# Altium schematic sheet 20200804PCB.SchDoc
size A2
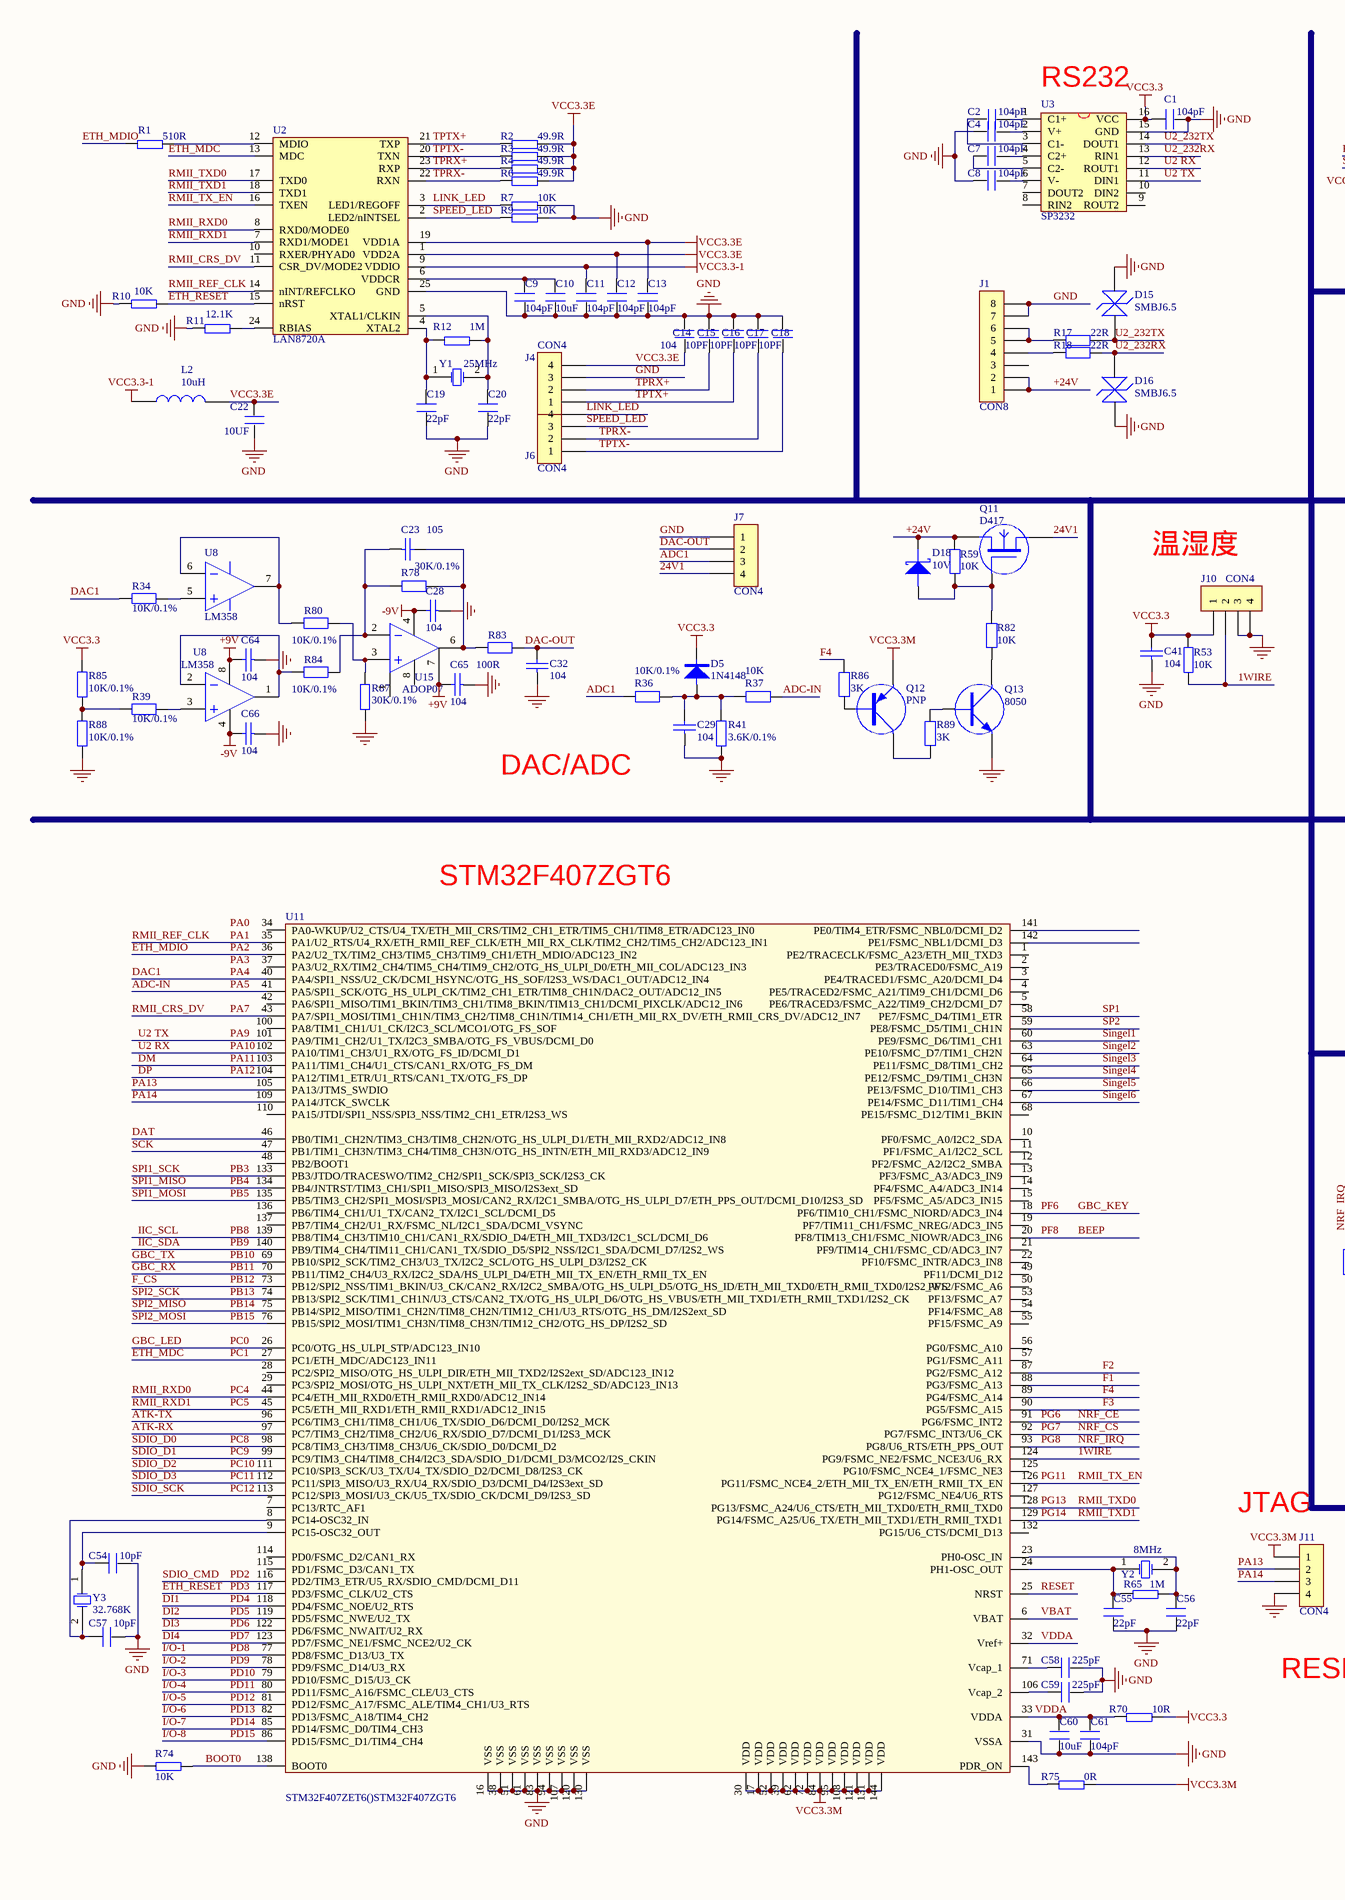
[diagram p0: 20200804PCB.SchDoc, left]
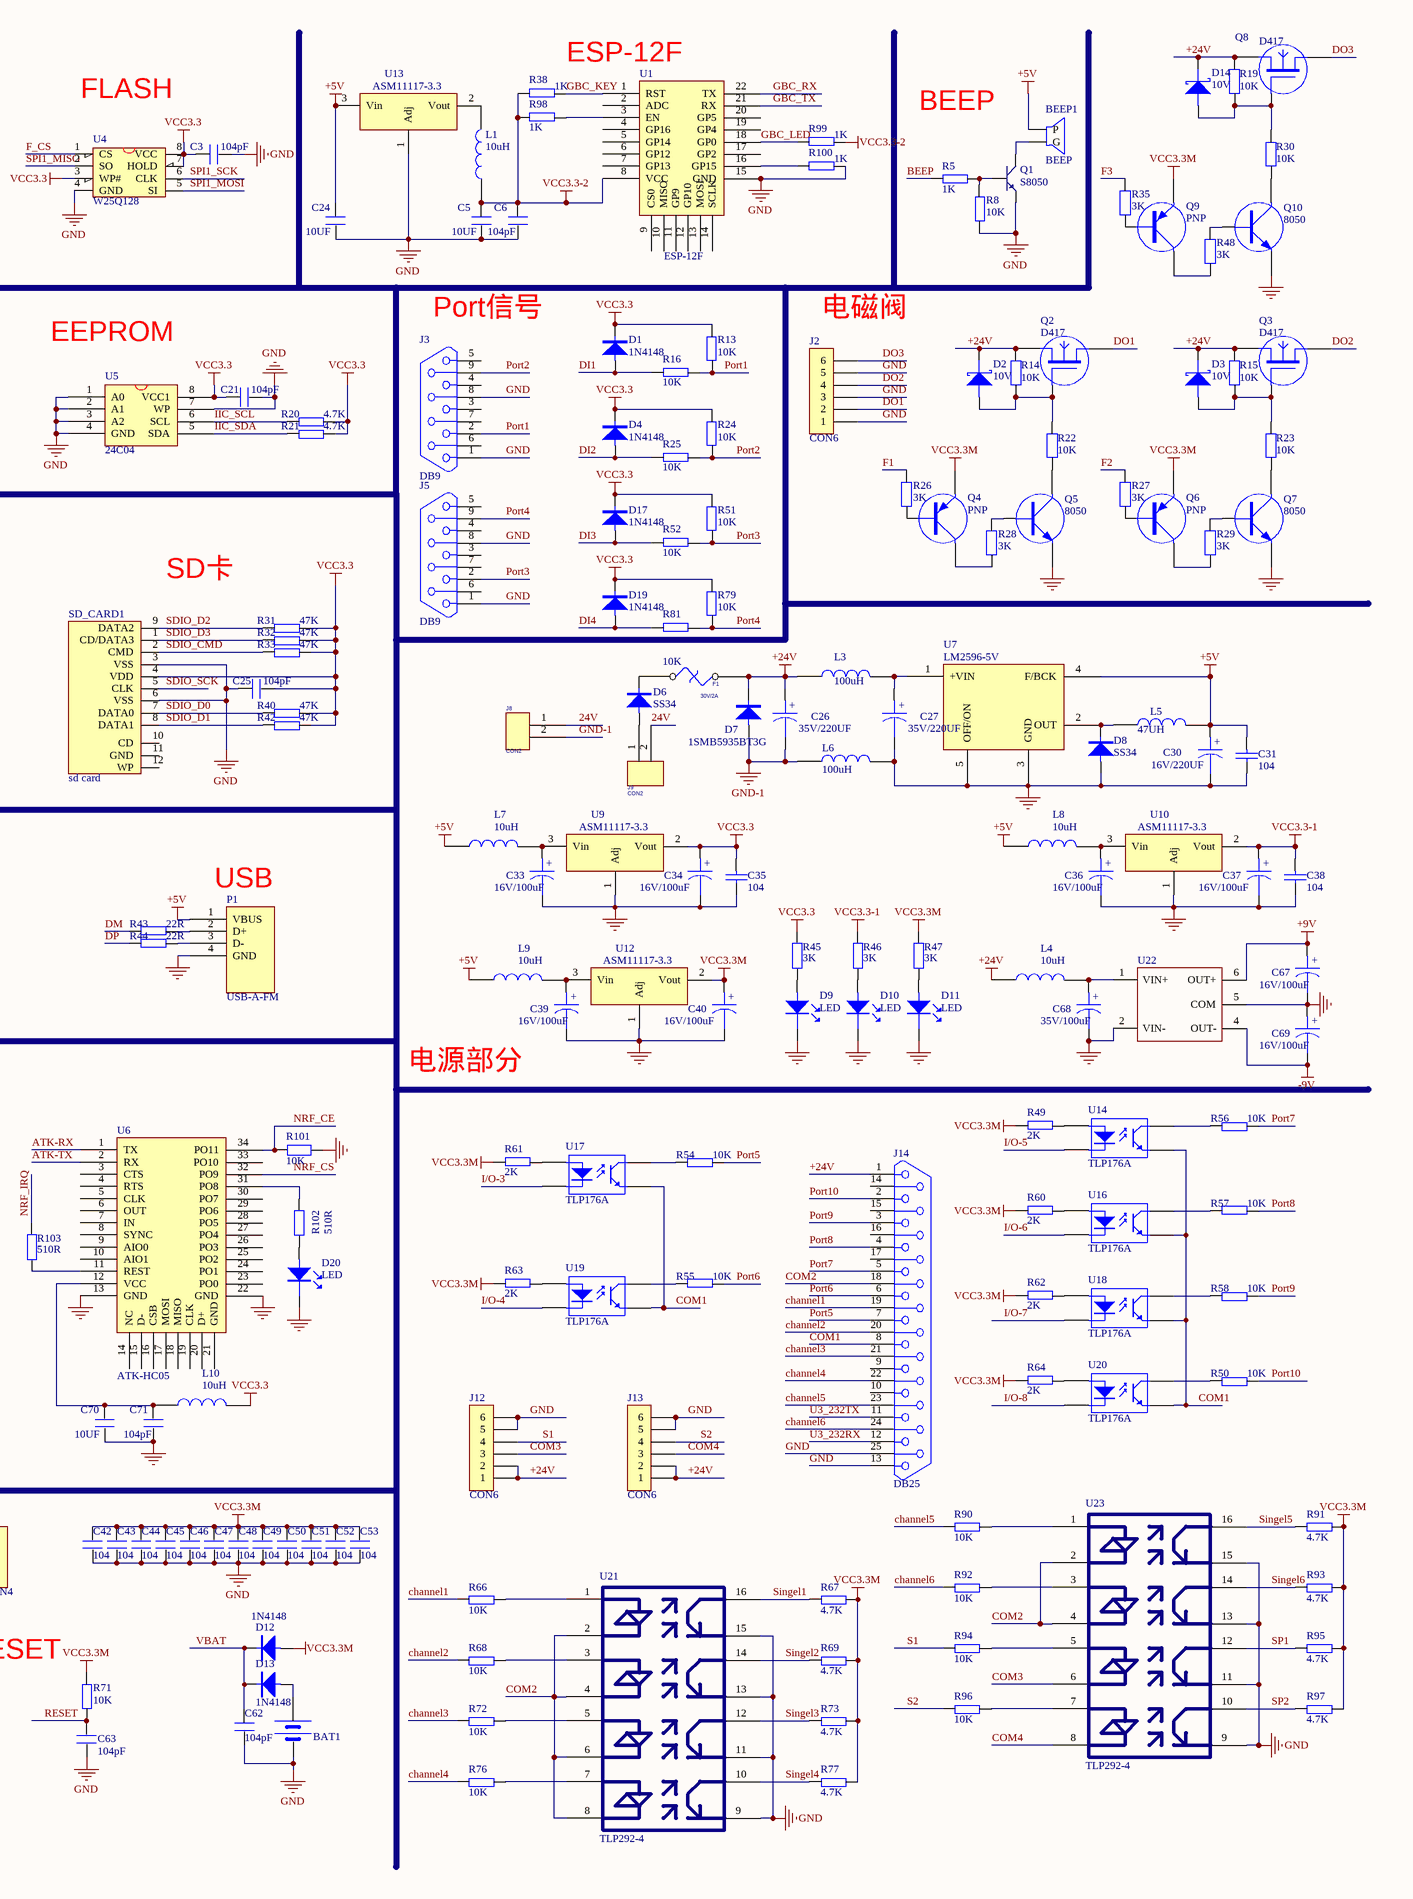
[diagram p1: 20200804PCB.SchDoc, right]

## Parts
(Parts that share a designator on the sheet are numbered #1, #2 ... from top to bottom, then left to right.)
BAT1  BATT  [BATM]  (value not drawn)
BEEP1  BEEP  [BELL-5]
C1  104pF  [0603]
C2  104pF  [0603]
C3  104pF  [0603]
C4  104pF  [0603]
C5  10UF  [0603]
C6  104pF  [0603]
C7  104pF  [0603]
C8  104pF  [0603]
C9  104pF  [0603]
C10  10uF  [0603]
C11  104pF  [0603]
C12  104pF  [0603]
C13  104pF  [0603]
C14  104  [0603]
C15  10PF  [0603]
C16  10PF  [0603]
C17  10PF  [0603]
C18  10PF  [0603]
C19  22pF  [0603]
C20  22pF  [0603]
C21  104pF  [0603]
C22  10UF  [0603]
C23  105  [0603]
C24  10UF  [0603]
C25  104pF  [0603]
C26  35V/220UF  [RB.1/.2]
C27  35V/220UF  [RB.1/.2]
C28  104  [0603]
C29  104  [0603]
C30  16V/220UF  [RB.1/.2]
C31  104  [0603]
C32  104  [0603]
C33  16V/100uF  [RB.06/.12]
C34  16V/100uF  [RB.06/.12]
C35  104  [0603]
C36  16V/100uF  [RB.06/.12]
C37  16V/100uF  [RB.06/.12]
C38  104  [0603]
C39  16V/100uF  [RB.06/.12]
C40  16V/100uF  [RB.06/.12]
C41  104  [0603]
C42  104  [0603]
C43  104  [0603]
C44  104  [0603]
C45  104  [0603]
C46  104  [0603]
C47  104  [0603]
C48  104  [0603]
C49  104  [0603]
C50  104  [0603]
C51  104  [0603]
C52  104  [0603]
C53  104  [0603]
C54  10pF  [0603]
C55  22pF  [0603]
C56  22pF  [0603]
C57  10pF  [0603]
C58  225pF  [0603]
C59  225pF  [0603]
C60  10uF  [0603]
C61  104pF  [0603]
C62  104pF  [0603]
C63  104pF  [0603]
C64  104  [0603]
C65  104  [0603]
C66  104  [0603]
C67  16V/100uF  [RB.06/.12]
C68  35V/100uF  [RB.06/.12]
C69  16V/100uF  [RB.06/.12]
C70  10UF  [0603]
C71  104pF  [0603]
D1  1N4148  [D1206DO]
D2  10V  [D1206DO]
D3  10V  [D1206DO]
D4  1N4148  [D1206DO]
D5  1N4148  [D1206DO]
D6  SS34  [D2010]
D7  1SMB5935BT3G  [DO-214AA]
D8  SS34  [D2010]
D9  LED  [D0603]
D10  LED  [D0603]
D11  LED  [D0603]
D12  1N4148  [D1206DO]
D13  1N4148  [D1206DO]
D14  10V  [D1206DO]
D15  SMBJ6.5  [DO-214AA]
D16  SMBJ6.5  [DO-214AA]
D17  1N4148  [D1206DO]
D18  10V  [D1206DO]
D19  1N4148  [D1206DO]
D20  LED  [D0603]
F1  30V/2A  [1812]
J1  CON8  [DXC8-2.54]
J2  CON6  [KF2EDGKD-2.5-6]
J3  DB9  [DB9/F]
J4  CON4  [SIP4]
J5  DB9  [DB9/F]
J6  CON4  [SIP4]
J7  CON4  [KF2EDGKD-2.5-4]
J8  CON2  [KF2EDGKD-2.5-2]
J9  CON2  [KF2EDGKD-2.5-2]
J10  CON4  [SIP4]
J11  CON4  [sip4]
J12  CON6  [KF2EDGKD-2.5-6]
J13  CON6  [KF2EDGKD-2.5-6]
J14  DB25  [DB25/F]
L1  10uH  [0805]
L2  10uH  [0805]
L3  100uH  [L-7*7]
L4  10uH  [L-7*7]
L5  47UH  [L-7*7]
L6  100uH  [L-7*7]
L7  10uH  [L-7*7]
L8  10uH  [L-7*7]
L9  10uH  [L-7*7]
L10  10uH  [0805]
P1  USB-A-FM  [USB-M-03]
Q1  S8050  [SOT-23R]
Q2  D417  [SOT-252]
Q3  D417  [SOT-252]
Q4  PNP  [SOT-23]
Q5  8050  [SOT-23]
Q6  PNP  [SOT-23]
Q7  8050  [SOT-23]
Q8  D417  [SOT-252]
Q9  PNP  [SOT-23]
Q10  8050  [SOT-23]
Q11  D417  [SOT-252]
Q12  PNP  [SOT-23]
Q13  8050  [SOT-23]
R1  510R  [0603]
R2  49.9R  [0603]
R3  49.9R  [0603]
R4  49.9R  [0603]
R5  1K  [0603]
R6  49.9R  [0603]
R7  10K  [0603]
R8  10K  [0603]
R9  10K  [0603]
R10  10K  [0603]
R11  12.1K  [0603]
R12  1M  [0603]
R13  10K  [0603]
R14  10K  [0603]
R15  10K  [0603]
R16  10K  [0603]
R17  22R  [0603]
R18  22R  [0603]
R19  10K  [0603]
R20  4.7K  [0603]
R21  4.7K  [0603]
R22  10K  [0603]
R23  10K  [0603]
R24  10K  [0603]
R25  10K  [0603]
R26  3K  [0603]
R27  3K  [0603]
R28  3K  [0603]
R29  3K  [0603]
R30  10K  [0603]
R31  47K  [0603]
R32  47K  [0603]
R33  47K  [0603]
R34  10K/0.1%  [0603]
R35  3K  [0603]
R36  10K/0.1%  [0603]
R37  10K  [0603]
R38  1K  [0603]
R39  10K/0.1%  [0603]
R40  47K  [0603]
R41  3.6K/0.1%  [0603]
R42  47K  [0603]
R43  22R  [0603]
R44  22R  [0603]
R45  3K  [0603]
R46  3K  [0603]
R47  3K  [0603]
R48  3K  [0603]
R49  2K  [0603]
R50  10K  [0603]
R51  10K  [0603]
R52  10K  [0603]
R53  10K  [0603]
R54  10K  [0603]
R55  10K  [0603]
R56  10K  [0603]
R57  10K  [0603]
R58  10K  [0603]
R59  10K  [0603]
R60  2K  [0603]
R61  2K  [0603]
R62  2K  [0603]
R63  2K  [0603]
R64  2K  [0603]
R65  1M  [0603]
R66  10K  [0603]
R67  4.7K  [0603]
R68  10K  [0603]
R69  4.7K  [0603]
R70  10R  [0603]
R71  10K  [0603]
R72  10K  [0603]
R73  4.7K  [0603]
R74  10K  [0603]
R75  0R  [0603]
R76  10K  [0603]
R77  4.7K  [0603]
R78  30K/0.1%  [0603]
R79  10K  [0603]
R80  10K/0.1%  [0603]
R81  10K  [0603]
R82  10K  [0603]
R83  100R  [0603]
R84  10K/0.1%  [0603]
R85  10K/0.1%  [0603]
R86  3K  [0603]
R87  30K/0.1%  [0603]
R88  10K/0.1%  [0603]
R89  3K  [0603]
R90  10K  [0603]
R91  4.7K  [0603]
R92  10K  [0603]
R93  4.7K  [0603]
R94  10K  [0603]
R95  4.7K  [0603]
R96  10K  [0603]
R97  4.7K  [0603]
R98  1K  [0603]
R99  1K  [0603]
R100  1K  [0603]
R101  10K  [0603]
R102  510R  [0603]
R103  510R  [0603]
SD_CARD1  sd card  [SDCARD_L]
U1  ESP-12F  [ESP-12F]
U2  LAN8720A  [QFN24]
U3  SP3232  [SOP16M]
U4  W25Q128  [SOIC-8]
U5  24C04  [SOIC-8]
U6  ATK-HC05  [ATK-HC05]
U7  LM2596-5V  [TO-263-5]
U8#1  LM358  [SO-8]
U8#2  LM358  [SO-8]
U9  ASM11117-3.3  [SOT-223]
U10  ASM11117-3.3  [SOT-223]
U11  STM32F407ZET6()STM32F407ZGT6  [LQFP144]
U12  ASM11117-3.3  [SOT-223]
U13  ASM11117-3.3  [SOT-223]
U14  TLP176A  [2.54SOP 4]
U15  ADOP07  [SO-8]
U16  TLP176A  [2.54SOP 4]
U17  TLP176A  [2.54SOP 4]
U18  TLP176A  [2.54SOP 4]
U19  TLP176A  [2.54SOP 4]
U20  TLP176A  [2.54SOP 4]
U21  TLP292-4  [SOP-16]
U22  A1209S-1W  [DCDC隔离电源_V2]  (value not drawn)
U23  TLP292-4  [SOP-16]
Y1  25MHz  [XTAL_US]
Y2  8MHz  [XTAL_US]
Y3  32.768K  [XTAL32]

## Nets
+5V: BEEP1.1(P) C24.2 C30.1 C31.1 L5.2 L7.1 L8.1 L9.1 P1.1(VBUS) U7.4(F/BCK) U13.3(Vin)
+9V: C64.2 C65.2 C67.1 U8#2.8(V+) U15.7(V+) U22.6(OUT+)
+24V: C26.1 D2.K D3.K D7.K D14.K D18.K F1.2 J1.1 J1.2 J12.1 J12.2 J13.1 J13.2 J14.1 L3.1 L4.1 Q2.3(S) Q3.3(S) Q8.3(S) Q11.3(S) R14.2 R15.2 R19.2 R59.2
-9V: C28.2 C66.2 C69.2 U8#2.4(V-) U15.4(V+) U22.4(OUT-)
GND: BAT1.2(GND) C1.2 C3.2 C4.1 C5.1 C6.1 C8.1 C9.1 C10.1 C11.1 C12.1 C13.1 C14.2 C15.2 C16.2 C17.2 C18.2 C19.1 C20.1 C21.2 C22.1 C24.1 C25.1 C27.2 C28.1 C29.1 C30.2 C31.2 C32.1 C33.2 C34.2 C35.2 C36.2 C37.2 C38.2 C39.2 C40.2 C41.1 C42.1 C43.1 C44.1 C45.1 C46.1 C47.1 C48.1 C49.1 C50.1 C51.1 C52.1 C53.1 C54.2 C55.1 C56.1 C57.2 C58.2 C59.2 C60.1 C61.1 C62.1 C63.2 C64.1 C65.1 C66.1 C67.2 C68.2 C69.1 C70.1 C71.1 D8.A D9.K D10.K D11.K D15.2 D16.2 D20.K J1.7 J1.8 J2.1 J2.3 J2.5 J3.1 J3.8 J4.3 J5.1 J5.8 J7.1 J10.3 J10.4 J11.4 J12.5 J12.6 J13.5 J13.6 J14.13 J14.25 L6.2 P1.4(GND) Q1.1(E) Q5.3(E) Q7.3(E) Q10.3(E) Q13.3(E) R7.2 R8.1 R9.2 R10.1 R11.1 R41.1 R74.1 R87.2 R88.2 R100.1 R101.2 SD_CARD1.3(VSS) SD_CARD1.6(VSS) U1.15(GND) U2.25(GND) U3.15(GND) U4.4(GND) U5.1(A0) U5.2(A1) U5.3(A2) U5.4(GND) U5.7(WP) U6.13(GND) U6.22(GND) U7.3(GND) U7.5(OFF/ON) U9.1(Adj) U10.1(Adj) U11.16(VSS) U11.31(VSSA) U11.38(VSS) U11.51(VSS) U11.61(VSS) U11.83(VSS) U11.94(VSS) U11.107(VSS) U11.120(VSS) U11.130(VSS) U12.1(Adj) U13.1(Adj) U21.9 U21.11 U21.13 U21.15 U22.2(VIN-) U22.5(COM) U23.9 U23.11 U23.13 U23.15
GND-1: C26.2 D7.A J8.2 L6.1
V+: U8#1.8(V+)
V-: U8#1.4(V-)
VCC3.3: C1.1 C3.1 C21.1 C25.2 C34.1 C35.1 C41.2 D1.K D4.K D5.K D17.K D19.K J10.1 L10.2 R13.1 R20.2 R21.2 R24.1 R31.2 R32.2 R33.2 R40.2 R42.2 R45.1 R51.1 R53.2 R70.2 R79.1 R85.1 SD_CARD1.4(VDD) U3.16(VCC) U4.3(WP#) U4.7(HOLD) U4.8(VCC) U5.8(VCC1) U9.2(Vout)
VCC3.3-1: C11.2 C37.1 C38.1 L2.1 R46.1 U2.9(VDDIO) U10.2(Vout)
VCC3.3-2: C5.2 C6.2 L1.1 R38.2 R98.2 R99.1 U1.8(VCC)
VCC3.3E: C12.2 C13.2 C14.1 C22.2 J4.4 L2.2 R2.2 R3.2 R4.2 R6.2 U2.1(VDD2A) U2.19(VDD1A)
VCC3.3M: C40.1 C42.2 C43.2 C44.2 C45.2 C46.2 C47.2 C48.2 C49.2 C50.2 C51.2 C52.2 C53.2 D12.A J11.1 Q4.3(E) Q6.3(E) Q9.3(E) Q12.3(E) R47.1 R49.2 R60.2 R61.2 R62.2 R63.2 R64.2 R67.2 R69.2 R71.2 R73.2 R75.2 R77.2 R91.2 R93.2 R95.2 R97.2 U11.17(VDD) U11.30(VDD) U11.39(VDD) U11.52(VDD) U11.62(VDD) U11.72(VDD) U11.84(VDD) U11.95(VDD) U11.108(VDD) U11.121(VDD) U11.131(VDD) U11.144(VDD) U12.2(Vout)
1WIRE: J10.2 R53.1 U11.124(PG9/FSMC_NE2/FSMC_NCE3/U6_RX)
24V: J8.1 J9.2
24V1: J7.4 Q11.2(D)
ADC1: J7.3 R36.1
ADC-IN: R37.2 U11.41(PA5/SPI1_SCK/OTG_HS_ULPI_CK/TIM2_CH1_ETR/TIM8_CH1N/DAC2_OUT/ADC12_IN5)  [also labelled PA5]
ATK-RX: U6.1(TX) U11.97(PC7/TIM3_CH2/TIM8_CH2/U6_RX/SDIO_D7/DCMI_D1/I2S3_MCK)
ATK-TX: U6.2(RX) U11.96(PC6/TIM3_CH1/TIM8_CH1/U6_TX/SDIO_D6/DCMI_D0/I2S2_MCK)
BEEP: R5.1 U11.20(PF8/TIM13_CH1/FSMC_NIOWR/ADC3_IN6)  [also labelled PF8]
BOOT0: R74.2 U11.138(BOOT0)
channel1: J14.19 R66.1
channel2: J14.20 R68.1
channel3: J14.21 R72.1
channel4: J14.22 R76.1
channel5: J14.23 R90.1
channel6: J14.24 R92.1
COM1: J14.8 U14.3(E) U16.3(E) U17.3(E) U18.3(E) U19.3(E) U20.3(E)
COM2: J14.18 U21.2 U21.4 U21.6 U21.8 U23.2 U23.4
COM3: J12.3 U23.6
COM4: J13.3 U23.8
DAC1: R34.2 U11.40(PA4/SPI1_NSS/U2_CK/DCMI_HSYNC/OTG_HS_SOF/I2S3_WS/DAC1_OUT/ADC12_IN4)  [also labelled PA4]
DAC-OUT: C32.2 J7.2 R83.1
DAT: U11.46(PB0/TIM1_CH2N/TIM3_CH3/TIM8_CH2N/OTG_HS_ULPI_D1/ETH_MII_RXD2/ADC12_IN8)
DI1: D1.A R16.2 U11.118(PD4/FSMC_NOE/U2_RTS)  [also labelled PD4]
DI2: D4.A R25.2 U11.119(PD5/FSMC_NWE/U2_TX)  [also labelled PD5]
DI3: D17.A R52.2 U11.122(PD6/FSMC_NWAIT/U2_RX)  [also labelled PD6]
DI4: D19.A R81.2 U11.123(PD7/FSMC_NE1/FSMC_NCE2/U2_CK)  [also labelled PD7]
DM: R43.2 U11.103(PA11/TIM1_CH4/U1_CTS/CAN1_RX/OTG_FS_DM)  [also labelled PA11]
DO1: J2.2 Q2.2(D)
DO2: J2.4 Q3.2(D)
DO3: J2.6 Q8.2(D)
DP: R44.2 U11.104(PA12/TIM1_ETR/U1_RTS/CAN1_TX/OTG_FS_DP)  [also labelled PA12]
ETH_MDC: U2.13(MDC) U11.27(PC1/ETH_MDC/ADC123_IN11)  [also labelled PC1]
ETH_MDIO: R1.1 U11.36(PA2/U2_TX/TIM2_CH3/TIM5_CH3/TIM9_CH1/ETH_MDIO/ADC123_IN2)  [also labelled PA2]
ETH_RESET: R10.2 U2.15(nRST) U11.117(PD3/FSMC_CLK/U2_CTS)  [also labelled PD3]
F1: R26.1 U11.88(PG3/FSMC_A13)
F2: R27.1 U11.87(PG2/FSMC_A12)
F3: R35.1 U11.90(PG5/FSMC_A15)
F4: R86.1 U11.89(PG4/FSMC_A14)
F_CS: U4.1(CS) U11.73(PB12/SPI2_NSS/TIM1_BKIN/U3_CK/CAN2_RX/I2C2_SMBA/OTG_HS_ULPI_D5/OTG_HS_ID/ETH_MII_TXD0/ETH_RMII_TXD0/I2S2_WS)  [also labelled PB12]
GBC_KEY: R38.1 U1.1(RST) U11.18(PF6/TIM10_CH1/FSMC_NIORD/ADC3_IN4)  [also labelled PF6]
GBC_LED: R99.2 U1.18(GP0) U11.26(PC0/OTG_HS_ULPI_STP/ADC123_IN10)  [also labelled PC0]
GBC_RX: U1.22(TX) U11.70(PB11/TIM2_CH4/U3_RX/I2C2_SDA/HS_ULPI_D4/ETH_MII_TX_EN/ETH_RMII_TX_EN)  [also labelled PB11]
GBC_TX: U1.21(RX) U11.69(PB10/SPI2_SCK/TIM2_CH3/U3_TX/I2C2_SCL/OTG_HS_ULPI_D3/I2S2_CK)  [also labelled PB10]
I/O-1: U11.77(PD8/FSMC_D13/U3_TX)  [also labelled PD8]
I/O-2: U11.78(PD9/FSMC_D14/U3_RX)  [also labelled PD9]
I/O-3: U11.79(PD10/FSMC_D15/U3_CK) U17.2(K)  [also labelled PD10]
I/O-4: U11.80(PD11/FSMC_A16/FSMC_CLE/U3_CTS) U19.2(K)  [also labelled PD11]
I/O-5: U11.81(PD12/FSMC_A17/FSMC_ALE/TIM4_CH1/U3_RTS) U14.2(K)  [also labelled PD12]
I/O-6: U11.82(PD13/FSMC_A18/TIM4_CH2) U16.2(K)  [also labelled PD13]
I/O-7: U11.85(PD14/FSMC_D0/TIM4_CH3) U18.2(K)  [also labelled PD14]
I/O-8: U11.86(PD15/FSMC_D1/TIM4_CH4) U20.2(K)  [also labelled PD15]
IIC_SCL: R20.1 U5.6(SCL) U11.139(PB8/TIM4_CH3/TIM10_CH1/CAN1_RX/SDIO_D4/ETH_MII_TXD3/I2C1_SCL/DCMI_D6)  [also labelled PB8]
IIC_SDA: R21.1 U5.5(SDA) U11.140(PB9/TIM4_CH4/TIM11_CH1/CAN1_TX/SDIO_D5/SPI2_NSS/I2C1_SDA/DCMI_D7/I2S2_WS)  [also labelled PB9]
LINK_LED: J6.4 R7.1 U2.3(LED1/REGOFF)
NRF_CE: R101.1 U6.34(PO11) U11.91(PG6/FSMC_INT2)  [also labelled PG6]
NRF_CS: U6.32(PO9) U11.92(PG7/FSMC_INT3/U6_CK)  [also labelled PG7]
NRF_IRQ: R103.1 U11.93(PG8/U6_RTS/ETH_PPS_OUT)  [also labelled PG8]
PA1: U2.14(nINT/REFCLKO) U11.35(PA1/U2_RTS/U4_RX/ETH_RMII_REF_CLK/ETH_MII_RX_CLK/TIM2_CH2/TIM5_CH2/ADC123_IN1)  [also labelled RMII_REF_CLK]
PA7: U2.11(CSR_DV/MODE2) U11.43(PA7/SPI1_MOSI/TIM1_CH1N/TIM3_CH2/TIM8_CH1N/TIM14_CH1/ETH_MII_RX_DV/ETH_RMII_CRS_DV/ADC12_IN7)  [also labelled RMII_CRS_DV]
PA9: U3.11(DIN1) U11.101(PA9/TIM1_CH2/U1_TX/I2C3_SMBA/OTG_FS_VBUS/DCMI_D0)  [also labelled U2 TX]
PA10: U3.12(ROUT1) U11.102(PA10/TIM1_CH3/U1_RX/OTG_FS_ID/DCMI_D1)  [also labelled U2 RX]
PA13: J11.2 U11.105(PA13/JTMS_SWDIO)
PA14: J11.3 U11.109(PA14/JTCK_SWCLK)
PB3: U4.6(CLK) U11.133(PB3/JTDO/TRACESWO/TIM2_CH2/SPI1_SCK/SPI3_SCK/I2S3_CK)  [also labelled SPI1_SCK]
PB4: U4.2(SO) U11.134(PB4/JNTRST/TIM3_CH1/SPI1_MISO/SPI3_MISO/I2S3ext_SD)  [also labelled SPI1_MISO]
PB5: U4.5(SI) U11.135(PB5/TIM3_CH2/SPI1_MOSI/SPI3_MOSI/CAN2_RX/I2C1_SMBA/OTG_HS_ULPI_D7/ETH_PPS_OUT/DCMI_D10/I2S3_SD)  [also labelled SPI1_MOSI]
PB13: U11.74(PB13/SPI2_SCK/TIM1_CH1N/U3_CTS/CAN2_TX/OTG_HS_ULPI_D6/OTG_HS_VBUS/ETH_MII_TXD1/ETH_RMII_TXD1/I2S2_CK)  [also labelled SPI2_SCK]
PB14: U11.75(PB14/SPI2_MISO/TIM1_CH2N/TIM8_CH2N/TIM12_CH1/U3_RTS/OTG_HS_DM/I2S2ext_SD)  [also labelled SPI2_MISO]
PB15: U11.76(PB15/SPI2_MOSI/TIM1_CH3N/TIM8_CH3N/TIM12_CH2/OTG_HS_DP/I2S2_SD)  [also labelled SPI2_MOSI]
PC4: U2.8(RXD0/MODE0) U11.44(PC4/ETH_MII_RXD0/ETH_RMII_RXD0/ADC12_IN14)  [also labelled RMII_RXD0]
PC5: U2.7(RXD1/MODE1) U11.45(PC5/ETH_MII_RXD1/ETH_RMII_RXD1/ADC12_IN15)  [also labelled RMII_RXD1]
PC8: R40.1 SD_CARD1.7(DATA0) U11.98(PC8/TIM3_CH3/TIM8_CH3/U6_CK/SDIO_D0/DCMI_D2)  [also labelled SDIO_D0]
PC9: R42.1 SD_CARD1.8(DATA1) U11.99(PC9/TIM3_CH4/TIM8_CH4/I2C3_SDA/SDIO_D1/DCMI_D3/MCO2/I2S_CKIN)  [also labelled SDIO_D1]
PC10: R31.1 SD_CARD1.9(DATA2) U11.111(PC10/SPI3_SCK/U3_TX/U4_TX/SDIO_D2/DCMI_D8/I2S3_CK)  [also labelled SDIO_D2]
PC11: R32.1 SD_CARD1.1(CD/DATA3) U11.112(PC11/SPI3_MISO/U3_RX/U4_RX/SDIO_D3/DCMI_D4/I2S3ext_SD)  [also labelled SDIO_D3]
PC12: SD_CARD1.5(CLK) U11.113(PC12/SPI3_MOSI/U3_CK/U5_TX/SDIO_CK/DCMI_D9/I2S3_SD)  [also labelled SDIO_SCK]
PD2: R33.1 SD_CARD1.2(CMD) U11.116(PD2/TIM3_ETR/U5_RX/SDIO_CMD/DCMI_D11)  [also labelled SDIO_CMD]
PG11: U2.16(TXEN) U11.126(PG11/FSMC_NCE4_2/ETH_MII_TX_EN/ETH_RMII_TX_EN)  [also labelled RMII_TX_EN]
PG13: U2.17(TXD0) U11.128(PG13/FSMC_A24/U6_CTS/ETH_MII_TXD0/ETH_RMII_TXD0)  [also labelled RMII_TXD0]
PG14: U2.18(TXD1) U11.129(PG14/FSMC_A25/U6_TX/ETH_MII_TXD1/ETH_RMII_TXD1)  [also labelled RMII_TXD1]
Port1: J3.2 R13.2 R16.1
Port2: J3.9 R24.2 R25.1
Port3: J5.2 R51.2 R52.1
Port4: J5.9 R79.2 R81.1
Port5: J14.7 R54.2
Port6: J14.6 R55.1
Port7: J14.5 R56.2
Port8: J14.4 R57.1
Port9: J14.3 R58.2
Port10: J14.2 R50.2
RESET: C63.1 R71.1 U11.25(NRST)
S1: J12.4 R94.1
S2: J13.4 R96.1
SCK: U11.47(PB1/TIM1_CH3N/TIM3_CH4/TIM8_CH3N/OTG_HS_INTN/ETH_MII_RXD3/ADC12_IN9)
Singel1: R67.1 U11.60(PE9/FSMC_D6/TIM1_CH1) U21.16
Singel2: R69.1 U11.63(PE10/FSMC_D7/TIM1_CH2N) U21.14
Singel3: R73.1 U11.64(PE11/FSMC_D8/TIM1_CH2) U21.12
Singel4: R77.1 U11.65(PE12/FSMC_D9/TIM1_CH3N) U21.10
Singel5: R91.1 U11.66(PE13/FSMC_D10/TIM1_CH3) U23.16
Singel6: R93.1 U11.67(PE14/FSMC_D11/TIM1_CH4) U23.14
SP1: R95.1 U11.58(PE7/FSMC_D4/TIM1_ETR) U23.12
SP2: R97.1 U11.59(PE8/FSMC_D5/TIM1_CH1N) U23.10
SPEED_LED: J6.3 R9.1 U2.2(LED2/nINTSEL)
TPRX+: C15.1 J4.2 R4.1 U2.23(RXP)
TPRX-: C17.1 J6.2 R6.1 U2.22(RXN)
TPTX+: C16.1 J4.1 R2.1 U2.21(TXP)
TPTX-: C18.1 J6.1 R3.1 U2.20(TXN)
U2_232RX: D16.1 R18.2 U3.13(RIN1)
U2_232TX: D15.1 R17.2 U3.14(DOUT1)
U3_232RX: J14.12
U3_232TX: J14.11
VBAT: C62.2 D12.K D13.K U11.6(VBAT)
VDDA: C60.2 C61.2 R70.1 U11.32(Vref+) U11.33(VDDA)
NetBAT1_1: BAT1.1(VCC) D13.A
NetBEEP1_2: BEEP1.2(G) Q1.3(C)
NetC2_1: C2.1 U3.1(C1+)
NetC2_2: C2.2 U3.3(C1-)
NetC4_2: C4.2 U3.2(V+)
NetC7_1: C7.1 U3.5(C2-)
NetC7_2: C7.2 U3.4(C2+)
NetC8_2: C8.2 U3.6(V-)
NetC9_2: C9.2 C10.2 U2.6(VDDCR)
NetC19_2: C19.2 R12.1 U2.4(XTAL2) Y1.1(OSC1)
NetC20_2: C20.2 R12.2 U2.5(XTAL1/CLKIN) Y1.2(OSC2)
NetC23_1: C23.1 R78.2 R84.1 U15.2(IN-)
NetC23_2: C23.2 R78.1 R83.2 U15.6(OUT)
NetC27_1: C27.1 L3.2 U7.1(+VIN)
NetC29_2: C29.2 D5.A R36.2 R37.1 R41.2
NetC33_1: C33.1 L7.2 U9.3(Vin)
NetC36_1: C36.1 L8.2 U10.3(Vin)
NetC39_1: C39.1 L9.2 U12.3(Vin)
NetC54_1: C54.1 U11.9(PC15-OSC32_OUT) Y3.1(OSC1)
NetC55_2: C55.2 R65.1 U11.24(PH1-OSC_OUT) Y2.1(OSC1)
NetC56_2: C56.2 R65.2 U11.23(PH0-OSC_IN) Y2.2(OSC2)
NetC57_1: C57.1 U11.8(PC14-OSC32_IN) Y3.2(OSC2)
NetC58_1: C58.1 U11.71(Vcap_1)
NetC59_1: C59.1 U11.106(Vcap_2)
NetC68_1: C68.1 L4.2 U22.1(VIN+)
NetC70_2: C70.2 C71.2 L10.1 U6.12(VCC)
NetD2_A: D2.A Q2.1(G) R14.1 R22.2
NetD3_A: D3.A Q3.1(G) R15.1 R23.2
NetD6_A: D6.A J9.1
NetD6_K: D6.K F1.1
NetD8_K: D8.K L5.1 U7.2(OUT)
NetD9_A: D9.A R45.2
NetD10_A: D10.A R46.2
NetD11_A: D11.A R47.2
NetD14_A: D14.A Q8.1(G) R19.1 R30.2
NetD18_A: D18.A Q11.1(G) R59.1 R82.2
NetD20_A: D20.A R102.2
NetJ1_4: J1.4 R18.1
NetJ1_5: J1.5 J1.6 R17.1
NetL1_2: L1.2 U13.2(Vout)
NetP1_2: P1.2(D+) R43.1
NetP1_3: P1.3(D-) R44.1
NetQ1_2: Q1.2(B) R5.2 R8.2
NetQ4_1: Q4.1(B) R26.2
NetQ4_2: Q4.2(C) R28.2
NetQ5_1: Q5.1(B) R28.1
NetQ5_2: Q5.2(C) R22.1
NetQ6_1: Q6.1(B) R27.2
NetQ6_2: Q6.2(C) R29.2
NetQ7_1: Q7.1(B) R29.1
NetQ7_2: Q7.2(C) R23.1
NetQ9_1: Q9.1(B) R35.2
NetQ9_2: Q9.2(C) R48.2
NetQ10_1: Q10.1(B) R48.1
NetQ10_2: Q10.2(C) R30.1
NetQ12_1: Q12.1(B) R86.2
NetQ12_2: Q12.2(C) R89.2
NetQ13_1: Q13.1(B) R89.1
NetQ13_2: Q13.2(C) R82.1
NetR1_2: R1.2 U2.12(MDIO)
NetR11_2: R11.2 U2.24(RBIAS)
NetR34_1: R34.1 U8#1.5(IN+)
NetR39_1: R39.1 U8#2.3(IN+)
NetR39_2: R39.2 R85.2 R88.1
NetR49_1: R49.1 U14.1(A)
NetR50_1: R50.1 U20.4(C)
NetR54_1: R54.1 U17.4(C)
NetR55_2: R55.2 U19.4(C)
NetR56_1: R56.1 U14.4(C)
NetR57_2: R57.2 U16.4(C)
NetR58_1: R58.1 U18.4(C)
NetR60_1: R60.1 U16.1(A)
NetR61_1: R61.1 U17.1(A)
NetR62_1: R62.1 U18.1(A)
NetR63_1: R63.1 U19.1(A)
NetR64_1: R64.1 U20.1(A)
NetR66_2: R66.2 U21.1
NetR68_2: R68.2 U21.3
NetR72_2: R72.2 U21.5
NetR75_1: R75.1 U11.143(PDR_ON)
NetR76_2: R76.2 U21.7
NetR80_1: R80.1 R87.1 U15.3(IN+)
NetR80_2: R80.2 U8#1.6(IN-) U8#1.7(OUT)
NetR84_2: R84.2 U8#2.1(OUT) U8#2.2(IN-)
NetR90_2: R90.2 U23.1
NetR92_2: R92.2 U23.3
NetR94_2: R94.2 U23.5
NetR96_2: R96.2 U23.7
NetR98_1: R98.1 U1.3(EN)
NetR100_2: R100.2 U1.16(GP15)
NetR102_1: R102.1 U6.31(PO8)
NetR103_2: R103.2 U6.11(REST)

Not connected (* = marked no-connect by the designer): J1 3; J3 3 4 5 6 7; J5 3 4 5 6 7; J14 9 10 14 15 16 17; SD_CARD1 10(CD) 11(GND) 12(WP); U1 2(ADC) 4(GP16) 5(GP14) 6(GP12) 7(GP13) 9(CS0) 10(MISO) 11(GP9) 12(GP10) 13(MOSI) 14(SCLK) 17(GP2) 19(GP4) 20(GP5); U2 10(RXER/PHYAD0); U3 7(DOUT2) 8(RIN2) 9(ROUT2) 10(DIN2); U6 3(CTS) 4(RTS) 5(CLK) 6(OUT) 7(IN) 8(SYNC) 9(AIO0) 10(AIO1) 14(NC) 15(D-) 16(CSB) 17(MOSI) 18(MISO) 19(CLK) 20(D+) 21(GND) 23(PO0) 24(PO1) 25(PO2) 26(PO3) 27(PO4) 28(PO5) 29(PO6) 30(PO7) 33(PO10); U11 1(PE2/TRACECLK/FSMC_A23/ETH_MII_TXD3) 2(PE3/TRACED0/FSMC_A19) 3(PE4/TRACED1/FSMC_A20/DCMI_D4) 4(PE5/TRACED2/FSMC_A21/TIM9_CH1/DCMI_D6) 5(PE6/TRACED3/FSMC_A22/TIM9_CH2/DCMI_D7) 7(PC13/RTC_AF1) 10(PF0/FSMC_A0/I2C2_SDA) 11(PF1/FSMC_A1/I2C2_SCL) 12(PF2/FSMC_A2/I2C2_SMBA) 13(PF3/FSMC_A3/ADC3_IN9) 14(PF4/FSMC_A4/ADC3_IN14) 15(PF5/FSMC_A5/ADC3_IN15) 19(PF7/TIM11_CH1/FSMC_NREG/ADC3_IN5) 21(PF9/TIM14_CH1/FSMC_CD/ADC3_IN7) 22(PF10/FSMC_INTR/ADC3_IN8) 28(PC2/SPI2_MISO/OTG_HS_ULPI_DIR/ETH_MII_TXD2/I2S2ext_SD/ADC123_IN12) 29(PC3/SPI2_MOSI/OTG_HS_ULPI_NXT/ETH_MII_TX_CLK/I2S2_SD/ADC123_IN13) 34(PA0-WKUP/U2_CTS/U4_TX/ETH_MII_CRS/TIM2_CH1_ETR/TIM5_CH1/TIM8_ETR/ADC123_IN0) 37(PA3/U2_RX/TIM2_CH4/TIM5_CH4/TIM9_CH2/OTG_HS_ULPI_D0/ETH_MII_COL/ADC123_IN3) 42(PA6/SPI1_MISO/TIM1_BKIN/TIM3_CH1/TIM8_BKIN/TIM13_CH1/DCMI_PIXCLK/ADC12_IN6) 48(PB2/BOOT1) 49(PF11/DCMI_D12) 50(PF12/FSMC_A6) 53(PF13/FSMC_A7) 54(PF14/FSMC_A8) 55(PF15/FSMC_A9) 56(PG0/FSMC_A10) 57(PG1/FSMC_A11) 68(PE15/FSMC_D12/TIM1_BKIN) 100(PA8/TIM1_CH1/U1_CK/I2C3_SCL/MCO1/OTG_FS_SOF) 110(PA15/JTDI/SPI1_NSS/SPI3_NSS/TIM2_CH1_ETR/I2S3_WS) 114(PD0/FSMC_D2/CAN1_RX) 115(PD1/FSMC_D3/CAN1_TX) 125(PG10/FSMC_NCE4_1/FSMC_NE3) 127(PG12/FSMC_NE4/U6_RTS) 132(PG15/U6_CTS/DCMI_D13) 136(PB6/TIM4_CH1/U1_TX/CAN2_TX/I2C1_SCL/DCMI_D5) 137(PB7/TIM4_CH2/U1_RX/FSMC_NL/I2C1_SDA/DCMI_VSYNC) 141(PE0/TIM4_ETR/FSMC_NBL0/DCMI_D2) 142(PE1/FSMC_NBL1/DCMI_D3); U15 1(V-) 8(OA2)

## Notes on the sheet
- (near U3) RS232
- FLASH
- ESP-12F
- BEEP
- EEPROM
- (near J3) Port信号
- (near J2) 电磁阀
- 温湿度
- SD卡
- DAC/ADC
- (near U11) STM32F407ZGT6
- (near P1) USB
- 电源部分
- (near J11) JTAG
- RESET
- Labels drawn without touching a wire or pin: PA0, PA3
- (in symbol CAPACITOR POL) +

## Library data of the parts
BAT1 = BAT
C1-C22 C24 C25 C42-C63 C70 C71 = C
C23 C28 C29 C31 C32 C35 C38 C41 C64-C66 = CAP: Capacitor
C26 C27 C30 C33 C34 C36 C37 C39 C40 C67-C69 = CAPACITOR POL: Capacitor
D1 D4-D8 D12 D13 D17 D19 = DIODE
D2 D3 D14 D18 = DIODE SCHOTTKY: Schottky Diode
D15 D16 = TVS: TVS/双向/SMA
F1 = THERMAL FUSE
J1 = CON8: Connector
J2 J12 J13 = CON6: Connector
J4 J6 J7 J10 J11 = CON4: Connector
L1-L10 = INDUCTOR
P1 = USB-A-FM: USB母座
Q1 = NPN: 8050/BCW846/BCW847
Q2 Q3 Q8 Q11 = MOSFET-N1
Q4 Q6 Q9 Q12 = PNP: PNP Transistor
Q5 Q7 Q10 Q13 = NPN: NPN Transistor
R1-R13 R16 R20 R21 R24 R25 R31-R33 R38 R40 R42-R44 R49-R52 R54-R58 R60-R77 R79 R81 R90-R100 = R
R14 R15 R19 R22 R23 R26-R30 R35 R48 R59 R82 R86 R89 = RES5
R17 R18 R34 R36 R37 R39 R41 R45-R47 R53 R78 R80 R83-R85 R87 R88 R101-R103 = RES3
U2 = LAN8720: ETH PHY
U3 = MAX3232
U4 = W25X16: W25X16;SST25VF016;MX25L1605
U5 = 24C256
U7 = LM2596S
U8#1 = OPAMP2
U8#2 = OPAMP1
U9 U10 U12 U13 = VOLTAGE-1084
U11 = STM32F407ZET6
U14 U16-U20 = OPTOISO1: Optoisolator
U15 = OP07
U21 U23 = Component_1
U22 = DCDC隔离电源_V2: DCDC隔离电源/A1209S-1W
Y1 Y2 = XTAL: Crystal Oscillator; Published: 8-Jun-2000; LatestRevisionDate: 17-Jul-2002; LatestRevisionNote: Re-released for DXP Platform.; Publisher: Altium Limited
Y3 = XTAL_1: Crystal Oscillator; Published: 8-Jun-2000; LatestRevisionDate: 17-Jul-2002; LatestRevisionNote: Re-released for DXP Platform.; Publisher: Altium Limited